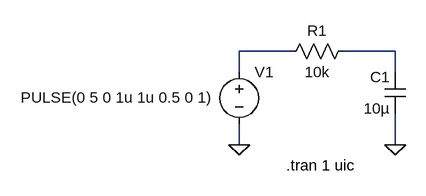
[diagram p0: schematic R-C3.asc]
R-C3.asc, the LTspice schematic file:
Version 4
SHEET 1 880 680
WIRE 128 96 48 96
WIRE 288 96 208 96
WIRE 48 128 48 96
WIRE 288 128 288 96
WIRE 48 240 48 208
WIRE 288 240 288 192
FLAG 288 240 0
FLAG 48 240 0
SYMBOL voltage 48 112 R0
WINDOW 123 -105 60 Left 2
WINDOW 39 0 0 Left 0
WINDOW 3 -336 55 Left 2
SYMATTR Value PULSE(0 5 0 1u 1u 0.5 0 1)
SYMATTR InstName V1
SYMBOL res 224 80 R90
WINDOW 0 0 56 VBottom 2
WINDOW 3 32 56 VTop 2
SYMATTR InstName R1
SYMATTR Value 10k
SYMBOL cap 304 192 R180
WINDOW 0 24 56 Left 2
WINDOW 3 24 8 Left 2
SYMATTR InstName C1
SYMATTR Value 10µ
TEXT 120 272 Left 2 !.tran 1 uic

The netlist it stands for:
* R-C3.asc
V1 N001 0 PULSE(0 5 0 1u 1u 0.5 0 1)
R1 N002 N001 10k
C1 0 N002 10µ
.tran 1 uic
.backanno
.end